# EAGLE board rcbussbc (EAGLE 9.6.2)
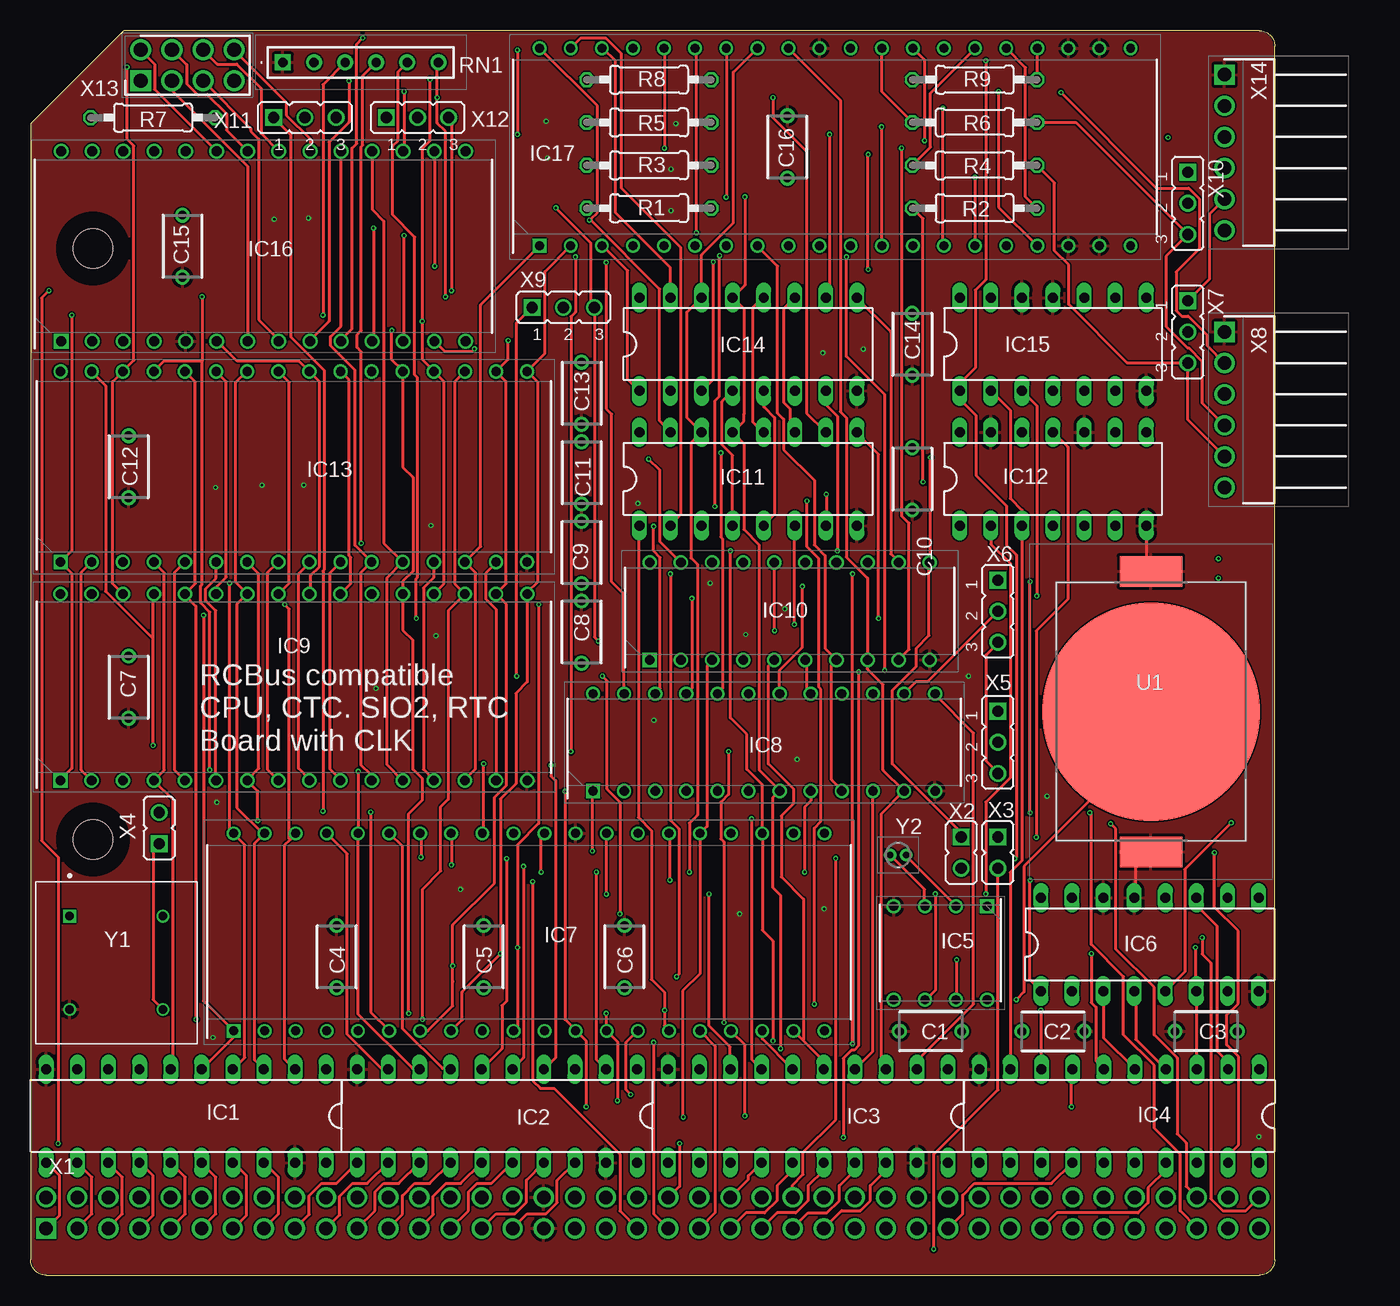
[diagram p2: board, top side]
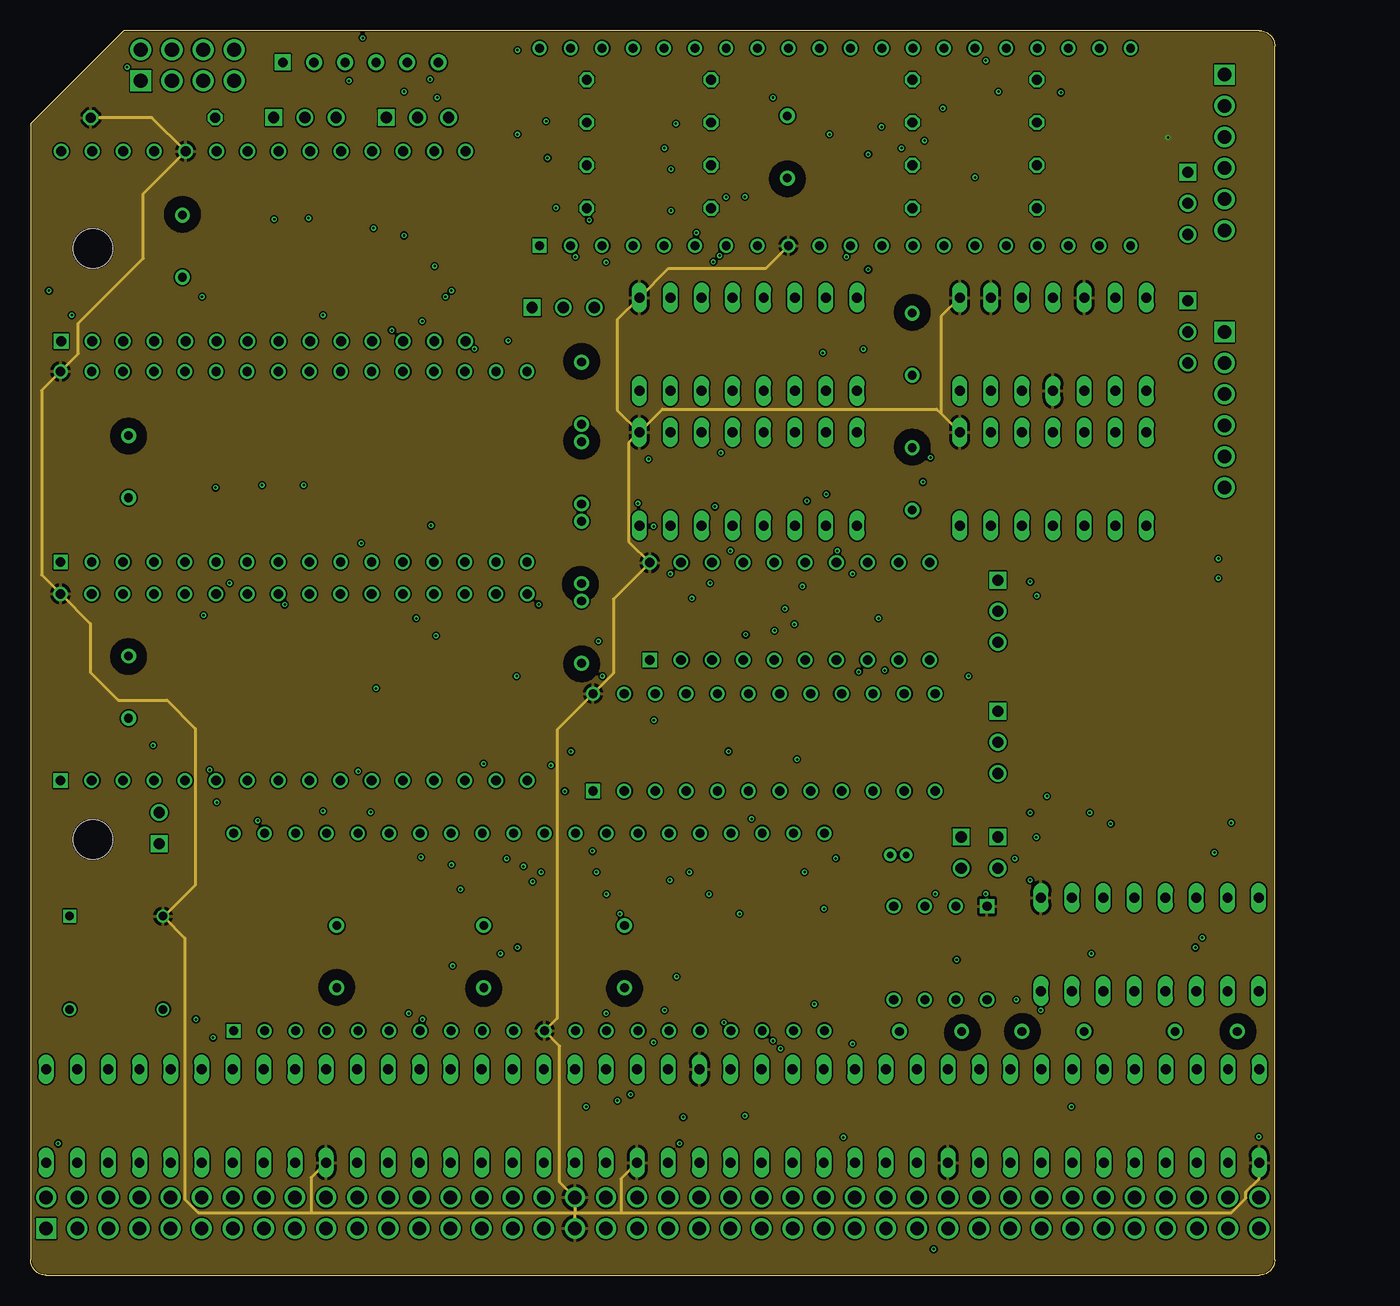
[diagram p3: board, inner layer Route2]
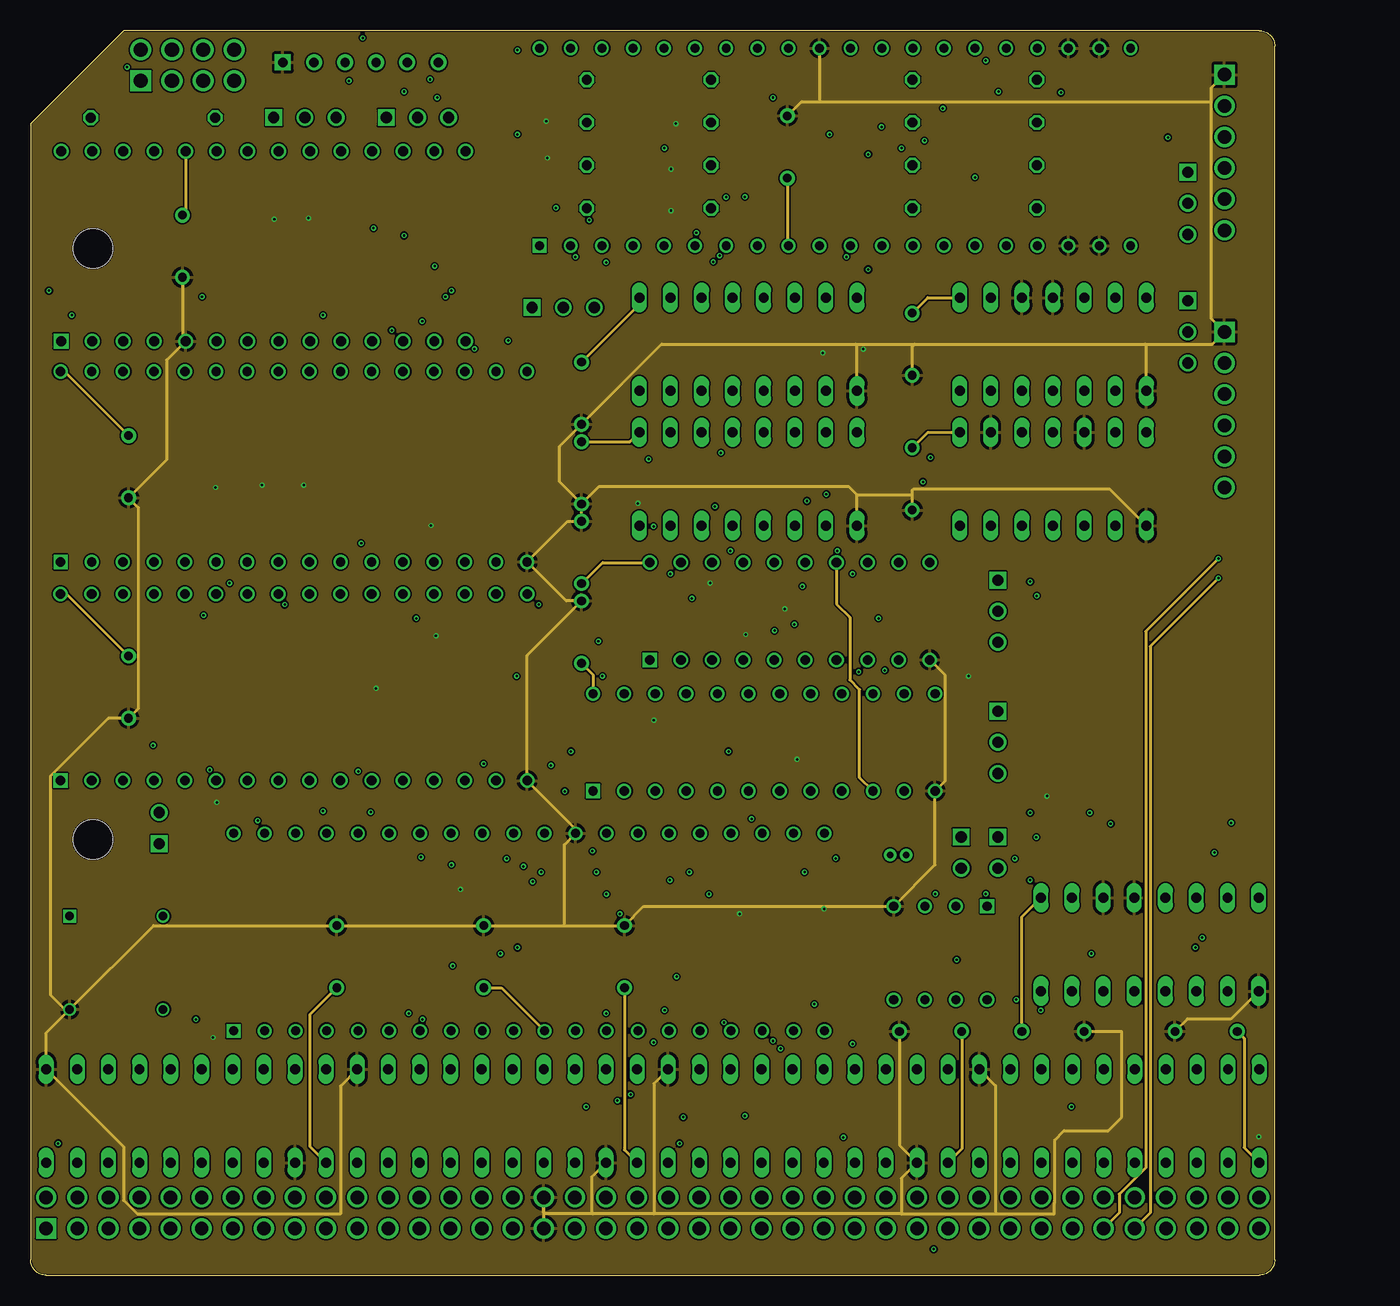
[diagram p4: board, inner layer Route15]
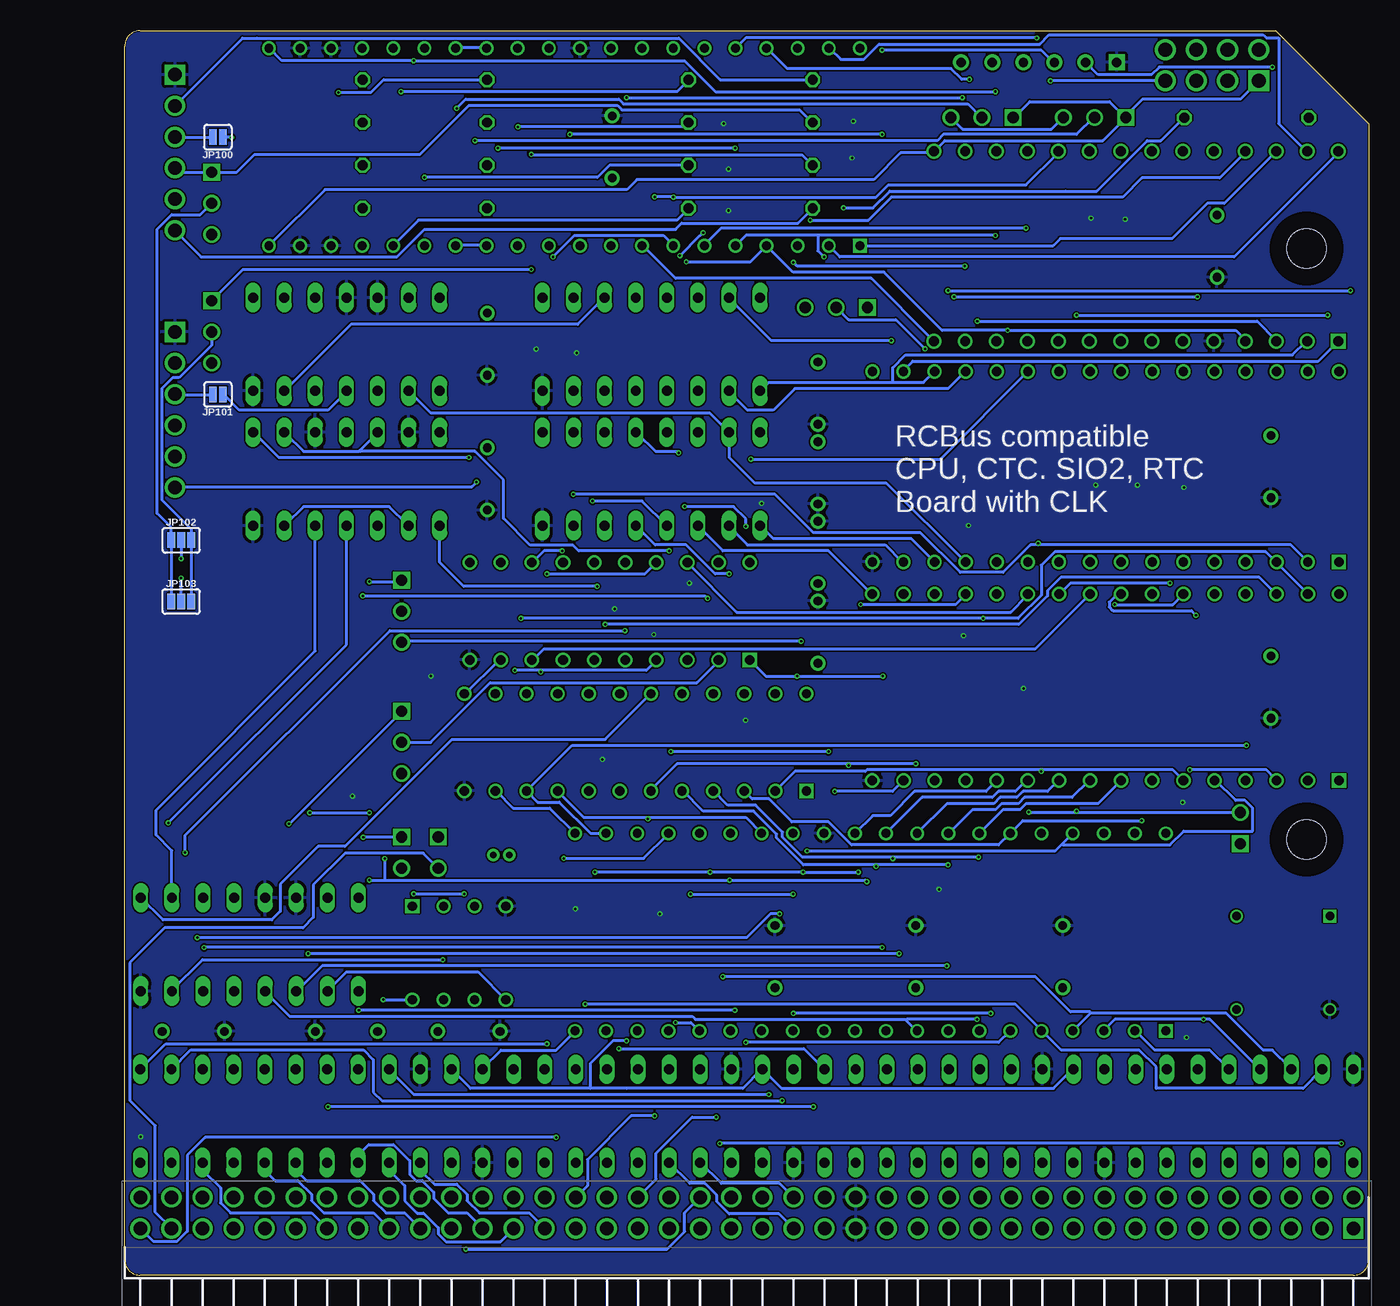
[diagram p5: board, bottom side, seen from below]

Size 101.6 x 101.6 mm. Coordinates in mm from the lower left corner, seen from the top.
Outline: 1.27,0 100.33,0 arc90 101.6,1.27 101.6,100.33 arc90 100.33,101.6 7.62,101.6 0,93.98 0,1.27 arc90 1.27,0
Copper layers (1*2*15*16): Top 0.035mm / dielectric 0.2mm / Route2 0.0175mm / dielectric 1.065mm / Route15 0.0175mm / dielectric 0.2mm / Bottom 0.035mm
Design rules "jlcpcb-4-layer_laci": minimum track width 5mil, minimum drill 0.2mm, track to track 0.126490625mm, track to pad 0.126490625mm, pad to pad 0.126490625mm, via to via 0.126490625mm, smd to smd 0mil, copper to edge 0.1mm, drill to drill 5mil, minimum pad ring 4mil, minimum via ring 4mil, stop-mask expansion 3mil, vias tented up to drill 100mil, thermal gap 10mil
Net classes: 0 default: width 0.254 mm; 1 pwr: width 0.762 mm
Holes 3.2 mm at 5.08,35.56 5.08,83.82
tRestrict: area 2.1,32.6 to 8.1,38.6; area 2.1,80.8 to 8.1,86.8
bRestrict: area 2.1,80.8 to 8.1,86.8; area 2.1,32.6 to 8.1,38.6

## Footprints (pad centres in the part's own frame; a part is rotated, then mirrored left to right if it is on the bottom)
C322C104K1R5TA = drill 0.71 pad 1.21: 1 -2.54,0; 2 2.54,0
DIL20 = drill 0.813 long: 1 -11.43,-3.81; 2 -8.89,-3.81; 3 -6.35,-3.81; 4 -3.81,-3.81; 5 -1.27,-3.81; 6 1.27,-3.81; 7 3.81,-3.81; 8 6.35,-3.81; 9 8.89,-3.81; 10 11.43,-3.81; 11 11.43,3.81; 12 8.89,3.81; 13 6.35,3.81; 14 3.81,3.81; 15 1.27,3.81; 16 -1.27,3.81; 17 -3.81,3.81; 18 -6.35,3.81; 19 -8.89,3.81; 20 -11.43,3.81
DIP762W56P254L938H457Q8N = drill 0.76 pad 1.16 square: 1 -3.81,3.81 | drill 0.76 pad 1.16: 2 -3.81,1.27; 3 -3.81,-1.27; 4 -3.81,-3.81; 5 3.81,-3.81; 6 3.81,-1.27; 7 3.81,1.27; 8 3.81,3.81
DIL16 = drill 0.813 long: 1 -8.89,-3.81; 2 -6.35,-3.81; 3 -3.81,-3.81; 4 -1.27,-3.81; 5 1.27,-3.81; 6 3.81,-3.81; 7 6.35,-3.81; 8 8.89,-3.81; 9 8.89,3.81; 10 6.35,3.81; 11 3.81,3.81; 12 1.27,3.81; 13 -1.27,3.81; 14 -3.81,3.81; 15 -6.35,3.81; 16 -8.89,3.81
DIP1612W53P254L5232H406Q40N = drill 0.73 pad 1.13 square: 1 -8.062,24.13 | drill 0.73 pad 1.13: 2 -8.062,21.59; 3 -8.062,19.05; 4 -8.062,16.51; 5 -8.062,13.97; 6 -8.062,11.43; 7 -8.062,8.89; 8 -8.062,6.35; 9 -8.062,3.81; 10 -8.062,1.27; 11 -8.062,-1.27; 12 -8.062,-3.81; 13 -8.062,-6.35; 14 -8.062,-8.89; 15 -8.062,-11.43; 16 -8.062,-13.97; 17 -8.062,-16.51; 18 -8.062,-19.05; 19 -8.062,-21.59; 20 -8.062,-24.13; 21 8.062,-24.13; 22 8.062,-21.59; 23 8.062,-19.05; 24 8.062,-16.51; 25 8.062,-13.97; 26 8.062,-11.43; 27 8.062,-8.89; 28 8.062,-6.35; 29 8.062,-3.81; 30 8.062,-1.27; 31 8.062,1.27; 32 8.062,3.81; 33 8.062,6.35; 34 8.062,8.89; 35 8.062,11.43; 36 8.062,13.97; 37 8.062,16.51; 38 8.062,19.05; 39 8.062,21.59; 40 8.062,24.13
DIP794W56P254L3188H533Q24N = drill 0.759 pad 1.159 square: 1 -3.969,13.97 | drill 0.759 pad 1.159: 2 -3.969,11.43; 3 -3.969,8.89; 4 -3.969,6.35; 5 -3.969,3.81; 6 -3.969,1.27; 7 -3.969,-1.27; 8 -3.969,-3.81; 9 -3.969,-6.35; 10 -3.969,-8.89; 11 -3.969,-11.43; 12 -3.969,-13.97; 13 3.969,-13.97; 14 3.969,-11.43; 15 3.969,-8.89; 16 3.969,-6.35; 17 3.969,-3.81; 18 3.969,-1.27; 19 3.969,1.27; 20 3.969,3.81; 21 3.969,6.35; 22 3.969,8.89; 23 3.969,11.43; 24 3.969,13.97
DIP1524W58P254L4191H406Q32N = drill 0.784 pad 1.184 square: 1 -7.62,19.05 | drill 0.784 pad 1.184: 2 -7.62,16.51; 3 -7.62,13.97; 4 -7.62,11.43; 5 -7.62,8.89; 6 -7.62,6.35; 7 -7.62,3.81; 8 -7.62,1.27; 9 -7.62,-1.27; 10 -7.62,-3.81; 11 -7.62,-6.35; 12 -7.62,-8.89; 13 -7.62,-11.43; 14 -7.62,-13.97; 15 -7.62,-16.51; 16 -7.62,-19.05; 17 7.62,-19.05; 18 7.62,-16.51; 19 7.62,-13.97; 20 7.62,-11.43; 21 7.62,-8.89; 22 7.62,-6.35; 23 7.62,-3.81; 24 7.62,-1.27; 25 7.62,1.27; 26 7.62,3.81; 27 7.62,6.35; 28 7.62,8.89; 29 7.62,11.43; 30 7.62,13.97; 31 7.62,16.51; 32 7.62,19.05
DIP794W59P254L2591H533Q20N = drill 0.788 pad 1.188 square: 1 -3.969,11.43 | drill 0.788 pad 1.188: 2 -3.969,8.89; 3 -3.969,6.35; 4 -3.969,3.81; 5 -3.969,1.27; 6 -3.969,-1.27; 7 -3.969,-3.81; 8 -3.969,-6.35; 9 -3.969,-8.89; 10 -3.969,-11.43; 11 3.969,-11.43; 12 3.969,-8.89; 13 3.969,-6.35; 14 3.969,-3.81; 15 3.969,-1.27; 16 3.969,1.27; 17 3.969,3.81; 18 3.969,6.35; 19 3.969,8.89; 20 3.969,11.43
DIL14 = drill 0.813 long: 1 -7.62,-3.81; 2 -5.08,-3.81; 3 -2.54,-3.81; 4 0,-3.81; 5 2.54,-3.81; 6 5.08,-3.81; 7 7.62,-3.81; 8 7.62,3.81; 9 5.08,3.81; 10 2.54,3.81; 11 0,3.81; 12 -2.54,3.81; 13 -5.08,3.81; 14 -7.62,3.81
DIP1556W56P254L4191H508Q32N = drill 0.758 pad 1.158 square: 1 -7.779,19.05 | drill 0.758 pad 1.158: 2 -7.779,16.51; 3 -7.779,13.97; 4 -7.779,11.43; 5 -7.779,8.89; 6 -7.779,6.35; 7 -7.779,3.81; 8 -7.779,1.27; 9 -7.779,-1.27; 10 -7.779,-3.81; 11 -7.779,-6.35; 12 -7.779,-8.89; 13 -7.779,-11.43; 14 -7.779,-13.97; 15 -7.779,-16.51; 16 -7.779,-19.05; 17 7.779,-19.05; 18 7.779,-16.51; 19 7.779,-13.97; 20 7.779,-11.43; 21 7.779,-8.89; 22 7.779,-6.35; 23 7.779,-3.81; 24 7.779,-1.27; 25 7.779,1.27; 26 7.779,3.81; 27 7.779,6.35; 28 7.779,8.89; 29 7.779,11.43; 30 7.779,13.97; 31 7.779,16.51; 32 7.779,19.05
DIL28 = drill 0.813 square: 1 -7.748,16.51 | drill 0.813: 2 -7.748,13.97; 3 -7.748,11.43; 4 -7.748,8.89; 5 -7.748,6.35; 6 -7.748,3.81; 7 -7.748,1.27; 8 -7.748,-1.27; 9 -7.748,-3.81; 10 -7.748,-6.35; 11 -7.748,-8.89; 12 -7.748,-11.43; 13 -7.748,-13.97; 14 -7.748,-16.51; 15 7.748,-16.51; 16 7.748,-13.97; 17 7.748,-11.43; 18 7.748,-8.89; 19 7.748,-6.35; 20 7.748,-3.81; 21 7.748,-1.27; 22 7.748,1.27; 23 7.748,3.81; 24 7.748,6.35; 25 7.748,8.89; 26 7.748,11.43; 27 7.748,13.97; 28 7.748,16.51
SMT-JUMPER_2_NO_SILK = smd 0.635 x 1.27: 1 -0.406,0; 2 0.406,0
SMT-JUMPER_3_NO_SILK = smd 0.635 x 1.27: 1 -0.813,0; 2 0,0; 3 0.813,0
0207/10 = drill 0.813 octagon: 1 -5.08,0; 2 5.08,0
4606X101102LF = drill 0.76 pad 1.303 square: 1 0,0 | drill 0.76 pad 1.303: 2 2.54,0; 3 5.08,0; 4 7.62,0; 5 10.16,0; 6 12.7,0
BATHLD001 = smd 2.5 x 5.1: 1 11.45,0; 2 -11.45,0 | smd 17.8 x 17.8: 3 0,0
RC2014_80_RA = drill 1.1 pad 1.65 square: 1 0,0 | drill 1.1 pad 1.65: 2 0,2.54; 3 2.54,0; 4 2.54,2.54; 5 5.08,0; 6 5.08,2.54; 7 7.62,0; 8 7.62,2.54; 9 10.16,0; 10 10.16,2.54; 11 12.7,0; 12 12.7,2.54; 13 15.24,0; 14 15.24,2.54; 15 17.78,0; 16 17.78,2.54; 17 20.32,0; 18 20.32,2.54; 19 22.86,0; 20 22.86,2.54; 21 25.4,0; 22 25.4,2.54; 23 27.94,0; 24 27.94,2.54; 25 30.48,0; 26 30.48,2.54; 27 33.02,0; 28 33.02,2.54; 29 35.56,0; 30 35.56,2.54; 31 38.1,0; 32 38.1,2.54; 33 40.64,0; 34 40.64,2.54; 35 43.18,0; 36 43.18,2.54; 37 45.72,0; 38 45.72,2.54; 39 48.26,0; 40 48.26,2.54; 41 50.8,0; 42 50.8,2.54; 43 53.34,0; 44 53.34,2.54; 45 55.88,0; 46 55.88,2.54; 47 58.42,0; 48 58.42,2.54; 49 60.96,0; 50 60.96,2.54; 51 63.5,0; 52 63.5,2.54; 53 66.04,0; 54 66.04,2.54; 55 68.58,0; 56 68.58,2.54; 57 71.12,0; 58 71.12,2.54; 59 73.66,0; 60 73.66,2.54; 61 76.2,0; 62 76.2,2.54; 63 78.74,0; 64 78.74,2.54; 65 81.28,0; 66 81.28,2.54; 67 83.82,0; 68 83.82,2.54; 69 86.36,0; 70 86.36,2.54; 71 88.9,0; 72 88.9,2.54; 73 91.44,0; 74 91.44,2.54; 75 93.98,0; 76 93.98,2.54; 77 96.52,0; 78 96.52,2.54; 79 99.06,0; 80 99.06,2.54
JP1 = drill 0.914 square: 1 0,-1.27 | drill 0.914: 2 0,1.27
JP2 = drill 0.914 square: 1 -2.54,0 | drill 0.914: 2 0,0; 3 2.54,0
HDRRA6W64P254_1X6_1524X254X309 = drill 1.1 pad 1.65 square: 1 0,0 | drill 1.1 pad 1.65: 2 2.54,0; 3 5.08,0; 4 7.62,0; 5 10.16,0; 6 12.7,0
HDRV8W67P254_2X4_1016X483X858P = drill 1.15 pad 1.725 square: 1 0,0 | drill 1.15 pad 1.725: 2 0,2.54; 3 2.54,0; 4 2.54,2.54; 5 5.08,0; 6 5.08,2.54; 7 7.62,0; 8 7.62,2.54
ECS-2100AX-200 = drill 0.7 square: 1 -3.81,-3.81 | drill 0.7: 4 3.81,-3.81; 5 3.81,3.81; 8 -3.81,3.81
LFXTAL014219BULK = drill 0.5 pad 1: 1 0,0; 2 0,-1.3

## Placement (x,y rotation side)
C1  C322C104M5U5TA  [C322C104K1R5TA]  73.5,19.9 180 top
C2  C322C104M5U5TA  [C322C104K1R5TA]  83.5,19.9 0 top
C3  C322C104M5U5TA  [C322C104K1R5TA]  96,19.9 180 top
C4  C322C104M5U5TA  [C322C104K1R5TA]  25,26 90 top
C5  C322C104M5U5TA  [C322C104K1R5TA]  37,26 90 top
C6  C322C104M5U5TA  [C322C104K1R5TA]  48.5,26 90 top
C7  C322C104M5U5TA  [C322C104K1R5TA]  8,48 270 top
C8  C322C104M5U5TA  [C322C104K1R5TA]  45,52.5 90 top
C9  C322C104M5U5TA  [C322C104K1R5TA]  45,59 90 top
C10  C322C104M5U5TA  [C322C104K1R5TA]  72,65 270 top
C11  C322C104M5U5TA  [C322C104K1R5TA]  45,65.5 270 top
C12  C322C104M5U5TA  [C322C104K1R5TA]  8,66 270 top
C13  C322C104M5U5TA  [C322C104K1R5TA]  45,72 270 top
C14  C322C104M5U5TA  [C322C104K1R5TA]  72,76 270 top
C15  C322C104M5U5TA  [C322C104K1R5TA]  12.4,84 270 top
C16  C322C104M5U5TA  [C322C104K1R5TA]  61.8,92.1 90 top
IC1  74LS245N  [DIL20]  12.7,13 180 top
IC2  74LS245N  [DIL20]  38.1,13 180 top
IC3  74LS245N  [DIL20]  63.5,13 180 top
IC4  74LS245N  [DIL20]  88.9,13 180 top
IC5  DS1302N+  [DIP762W56P254L938H457Q8N]  74.3,26.3 270 top
IC6  74HCT174N  [DIL16]  91.4,27 0 top
IC7  Z80_CPU  [DIP1612W53P254L5232H406Q40N]  40.7,28 90 top
IC8  ATF22V10C-15PU  [DIP794W56P254L3188H533Q24N]  59.9,43.5 90 top
IC9  AS6C4008-55PCN  [DIP1524W58P254L4191H406Q32N]  21.5,48 90 top
IC10  ATF16V8B-15PU  [DIP794W59P254L2591H533Q20N]  62,54.2 90 top
IC11  74LS670N  [DIL16]  58.6,65 0 top
IC12  74AC125N  [DIL14]  83.5,65 0 top
IC13  SST39SF040-70-4C-PHE  [DIP1556W56P254L4191H508Q32N]  21.5,66 90 top
IC14  74LS670N  [DIL16]  58.6,76 0 top
IC15  74LS74N  [DIL14]  83.5,76 0 top
IC16  Z80_CTC  [DIL28]  19,84 90 top
IC17  Z80_SIO2  [DIP1612W53P254L5232H406Q40N]  65.7,92.1 90 top
JP100  JUMPER-SMT_2_NO_SILK  [SMT-JUMPER_2_NO_SILK]  94,92.9 180 bottom
JP101  JUMPER-SMT_2_NO_SILK  [SMT-JUMPER_2_NO_SILK]  94,71.9 180 bottom
JP102  JUMPER-SMT_3_NO_SILK  [SMT-JUMPER_3_NO_SILK]  97,60 0 bottom
JP103  JUMPER-SMT_3_NO_SILK  [SMT-JUMPER_3_NO_SILK]  97,55 0 bottom
R1  1k  [0207/10]  50.5,87.1 180 top
R2  1k  [0207/10]  77.1,87.1 180 top
R3  1k  [0207/10]  50.5,90.6 180 top
R4  1k  [0207/10]  77.1,90.6 0 top
R5  1k  [0207/10]  50.5,94.1 180 top
R6  1k  [0207/10]  77.1,94.1 0 top
R7  1k  [0207/10]  10,94.5 180 top
R8  1k  [0207/10]  50.5,97.6 180 top
R9  1k  [0207/10]  77.1,97.6 180 top
RN1  4606X-101-102LF  [4606X101102LF]  20.6,99 0 top
U1  BAT-HLD-001  [BATHLD001]  91.5,46 90 top
X1  [RC2014_80_RA]  1.27,3.81 0 top
X2  [JP1]  76,34.5 180 top
X3  [JP1]  79,34.5 180 top
X4  [JP1]  10.5,36.5 0 top
X5  [JP2]  79,43.5 270 top
X6  [JP2]  79,54.2 270 top
X7  [JP2]  94.5,77 270 top
X8  TSW-106-08-T-S-RA  [HDRRA6W64P254_1X6_1524X254X309]  97.5,77 270 top
X9  [JP2]  43.5,79 0 top
X10  [JP2]  94.5,87.5 270 top
X11  [JP2]  22.4,94.5 0 top
X12  [JP2]  31.6,94.5 0 top
X13  10129381-908002BLF  [HDRV8W67P254_2X4_1016X483X858P]  9,97.5 0 top
X14  TSW-106-08-T-S-RA  [HDRRA6W64P254_1X6_1524X254X309]  97.5,98 270 top
Y1  7.3MHz  [ECS-2100AX-200]  7,25.5 270 top
Y2  LFXTAL014219BULK  [LFXTAL014219BULK]  70.2,34.3 90 top

## Tracks (layer width: path | path; a pad name or v marks a point on that pad's centre or on a via)
5P  (via drill 0.2)
  Route2 0.254: Y1.8 10.86,29.26 | 10.86,29.26 12.6,27.52 12.6,6.2 13.7,5.1 22.9,5.1 | 22.9,5.1 44.5,5.1 | IC1.20 22.9,7.96 22.9,5.1 | IC4.20 100.33,7.88 99.25,6.8 99.25,6.29 98.06,5.1 48.2,5.1 | IC2.20 48.2,7.86 48.2,5.1 | R7.2 9.9,94.5 IC16.24 9.2,88.3 9.2,83 3.9,77.7 3.9,75.23 IC13.32 0.9,72.23 0.9,57.17 IC9.32 4.88,53.19 4.88,49.22 7.17,46.94 11.13,46.94 13.45,44.62 13.45,31.85 10.86,29.26 | IC17.9 60.05,82.2 52.1,82.2 IC14.16 47.9,78 47.9,70.62 IC11.16 | IC11.16 51.6,70.7 73.99,70.7 74.34,70.34 | 74.34,70.34 IC12.14 | IC15.14 74.34,78.28 74.34,70.34 | IC11.16 48.85,67.95 48.85,59.89 IC10.20 47.6,55.2 47.6,49.14 IC8.24 43,44.54 43,20.97 IC7.11 43.2,18.71 43.2,7.6 X1.36 44.5,6.3 44.5,5.1 | 44.5,5.1 48.2,5.1 | X1.35 44.45,5.05 44.5,5.1
  Route15 0.254: C6.1 48.5,10.22 IC2.20 | C5.1 38.45,23.46 IC7.11 | C4.1 22.8,21.26 22.8,10.52 IC1.20 | C1.1 76.04,10.3 IC3.20 | C3.1 99.1,19.34 99.1,10.42 IC4.20 | IC16.24 12.65,86.79 C15.1 | C8.1 45.93,49.03 IC8.24 | C9.1 46.71,58.17 IC10.20 | C11.1 48.94,68.04 IC11.16 | C13.1 49.71,79.25 IC14.16 | C14.1 73.27,79.81 IC15.14 | C10.1 73.27,68.81 IC12.14 | C16.1 61.8,84.13 IC17.9 | C2.1 80.96,29.26 IC6.16 | C12.1 2.76,73.78 IC13.32 | C7.1 2.92,55.62 IC9.32
  Bottom 0.254: JP101.1 93.5,71.88 92.25,70.62 85,70.62 83.5,72.12 IC15.4 | v92.88,92.88 93.5,92.88 JP100.1
  pour Route2: -0.1,0 -0.1,101.8 101.5,101.8 101.5,0
5PR  (via drill 0.2)
  Top 0.254: X5.3 79,41 78,42 78,50.62 79,51.62 X6.3 | v42.9,87.12 42.9,87.1 45.75,84.25 45.75,79.25 46,79 X9.3 46.04,52.09 v46.38,51.75
  Bottom 0.254: v42.9,87.12 40.5,87.12 39.12,88.5 24.75,88.5 22.23,88.5 18.1,92.62 17,92.62 15.12,94.5 R7.1 | v46.38,51.75 79,51.75 X6.3
!BUSACK  (via drill 0.2)
  Top 0.254: X3.2 79,15.12 73.75,9.88 v73.75,2.12
  Bottom 0.254: v73.75,2.12 57.31,2.12 55.88,3.56 55.88,5.08 X1.44
!BUSREQ  (via drill 0.2)
  Top 0.254: IC10.3 55.65,50.15 55.25,49.75 55.25,36.64 IC7.25 54.67,24.62 53.25,23.2 53.25,12.95 v53.3,12.9
  Bottom 0.254: X1.48 58.2,7.84 58.2,9.97 55.27,12.9 v53.3,12.9
!CTC_CE  (via drill 0.2)
  Top 0.254: IC16.16 33,91.72 v33,82.38 | v47,82.67 47,70.75 47.45,70.3 47.45,56.6 48.47,55.59 IC8.23
  Bottom 0.254: v33,82.38 46.7,82.38 v47,82.67
!DBUF  (via drill 0.2)
  Top 0.254: v60.75,52.62 60.75,58.12 IC10.16 | IC4.19 97.79,9.8 98.65,10.66 98.65,17.83 97.68,18.8 97.68,21.24 98.61,22.17 98.61,28.12 96.67,30.05 v96.67,34.5
  Bottom 0.254: v60.75,52.62 79.95,52.62 96.67,35.9 v96.67,34.5
!DTRA
  Bottom 0.254: IC17.16 79.62,84.12 77.62,86.12 56.5,86.12 55.62,87 R1.1
!DTRB
  Top 0.254: R2.1 81.25,88.03 81.25,98.58 IC17.25
!HALT
  Top 0.254: IC3.14 58.62,8.12 58.62,7.83 X1.46
!IHALT
  Top 0.254: IC3.6 59.75,19.29 IC7.18
!IIODI
  Top 0.254: IC8.14 72.33,48.47 73.27,48.47 X6.2
!IIORQ  (via drill 0.2)
  Top 0.254: IC8.13 73.88,47.38 77,44.25 77,22.12 72.5,17.62 72.5,16.88 IC3.2 | v27.12,101 26.62,100.5 26.62,92.38 26.25,92 26.25,77.25 25.35,76.35 IC16.10 | v71.12,92 71.12,62 71.74,61.39 71.74,57.8 71.74,57.74 71.74,51.08 IC10.9 | v51.75,92 51.75,100.12 IC17.36
  Bottom 0.254: IC8.13 73.75,47.5 71.12,50.12 71,50.12 IC10.9 | IC7.20 64.88,19.88 66.38,18.38 70.88,18.38 72.38,16.88 IC3.2 | v27.12,101 50.88,101 51.62,100.25 IC17.36 | v51.75,92 v71.12,92
!IM1  (via drill 0.2)
  Top 0.254: IC8.9 66.25,39.62 65.42,40.46 65.42,49.79 65.81,50.19 IC10.7 64.88,51.17 64.88,58.75 64,59.62 64,64.9 61.5,67.4 61.5,69.88 61,70.38 61,82.38 59.38,84 IC17.8 | IC3.7 58.88,17.62 v58.88,37.25
  Bottom 0.254: IC17.8 59.25,84 56.62,81.38 40.62,81.38 35.62,76.38 IC16.14 | 58.88,37.38 64.12,37.38 66.25,39.5 IC8.9 | 58.88,37.38 50.88,37.38 49.62,36.12 IC7.27 | v58.88,37.25 58.88,37.38
!IMEMDI
  Bottom 0.254: X5.2 76.62,43.5 71.75,48.38 54.88,48.38 53.12,50.12 IC10.2
!IMREQ
  Top 0.254: 63.06,19.19 64.75,17.5 64.75,16.88 IC3.5 | 63.06,19.19 62.38,19.88 IC7.19 | IC10.5 60.62,50.12 60.25,49.75 60.25,41.75 62.3,39.7 62.3,38.5 61.3,37.5 61.3,32.52 63.12,30.7 63.12,19.25 63.06,19.19
!INT  (via drill 0.2)
  Top 0.254: X1.43 54.55,3.85 54.65,3.85 55.9,5.1 55.9,18.71 IC7.16 | v56.62,20.62 56.62,35.38 56.38,35.62 56.38,38.62 57,39.25 v57,42.75 | v44.12,42.75 44.12,78.25 44.5,78.62 v44.5,83.12 | IC16.12 30.5,76.32 v30.5,84.88
  Bottom 0.254: v30.5,84.88 45,84.88 | 45,84.88 50.88,84.88 51.62,84.12 IC17.5 | v56.62,20.62 55.38,20.62 54.75,20 IC7.16 | v44.12,42.75 v57,42.75 | v44.5,83.12 45,83.62 45,84.88
!IODI  (via drill 0.2)
  Top 0.254: v81.62,37.75 v81.62,56.62 | v86.5,37.75 86.62,37.62 86.62,27 89.25,24.38 89.25,19.62 91.75,17.12 91.75,12 93.88,9.88 93.88,5.25 95.25,3.88 X1.75
  Bottom 0.254: v81.62,56.62 79,56.62 X6.1 | v86.5,37.75 v81.62,37.75
!IORQ
  Top 0.254: X1.51 66.23,5.27 67.76,5.27 68.58,6.09 68.58,7.31 69.85,8.58 IC3.18
!IRD
  Top 0.254: IC17.32 66.12,95.93 66.12,70.5 66.62,70 66.62,58.62 68.35,56.9 IC10.8 68.35,49.48 69.62,48.2 69.62,41.24 IC8.11 69.45,37.65 69.45,17.21 IC3.3 | IC9.24 22.88,55.73 22.88,57.12 23.6,57.85 23.6,72.95 IC13.24 21.92,74.62 16.88,74.62 15.25,76.25 IC16.6
  Bottom 0.254: IC9.24 22.88,55.5 27.25,51.12 67.38,51.12 68.25,50.25 IC10.8 | IC8.11 71.28,39.53 69.88,38.12 66.89,38.12 IC7.21
!IRFSH  (via drill 0.2)
  Top 0.254: IC3.8 57.12,16.84 57.12,18.64 55.4,20.37 v55.4,31.1 | v47.02,31.1 47.05,31.12 IC7.28
  Bottom 0.254: v55.4,31.1 v47.02,31.1
!IWR  (via drill 0.2)
  Top 0.254: IC9.29 10,55.5 10,51.95 | IC3.4 68.75,18.25 68.75,39.49 IC8.10 | v10,43.25 10,51.95 | IC13.31 4.99,73.76 6.12,72.62 6.12,55.83 10,51.95
  Route15 0.254: IC10.14 65.81,54.79 66.9,53.7 66.9,48.6 67.7,47.8 67.7,40.62 IC8.10
  Bottom 0.254: v10,43.25 65.07,43.25 IC8.10 67.88,38.62 66.12,38.62 63.56,36.06 IC7.22
!M1
  Bottom 0.254: X1.37 48.18,5 52.24,5 53.25,6 53.25,6.51 54.23,7.5 55.46,7.5 IC3.13
!MEMDI  (via drill 0.2)
  Top 0.254: v88.2,36.85 88.62,36.42 88.62,26.62 91.75,23.5 91.75,19.62 93.64,17.74 93.64,11.54 94.38,10.8 94.38,7.25 95.25,6.38 X1.76
  Bottom 0.254: v88.2,36.85 88.15,36.85 79,46 X5.1
!MREQ
  Top 0.254: IC3.15 62.23,8.58 60.96,7.31 60.96,6.09 59.95,5.08 58.42,5.08 X1.45
!NMI  (via drill 0.2)
  Top 0.254: v58.33,13 58.33,18.8 57.25,19.88 IC7.17
  Bottom 0.254: X1.52 63.81,7.31 63.81,9.44 60.25,13 v58.33,13
!PG_WR  (via drill 0.2)
  Top 0.254: v56.38,67.12 56.38,60.25 56.5,60.12 56.5,47.88 56.12,47.5 IC8.20 | IC14.12 59.75,79.75 59,79 59,69.62 59.75,68.88 IC11.12
  Bottom 0.254: v56.38,67.12 56.5,67.25 58.25,67.25 59.75,68.75 IC11.12
!PGEN_WR  (via drill 0.2)
  Top 0.254: v54,55.25 54,47.92 IC8.21 | v82.17,55.45 82.2,55.48 82.2,70.95 IC15.3
  Bottom 0.254: v82.17,55.45 54.2,55.45 v54,55.25
!RAM_CS
  Bottom 0.254: IC9.22 27.88,55.5 29.25,54.12 51.62,54.12 55.62,58.12 IC10.18
!RD
  Top 0.254: X1.49 63.5,5.08 65.03,5.08 66.04,6.09 66.04,7.31 67.31,8.58 IC3.17
!RESET  (via drill 0.2)
  Top 0.254: v81.62,32.25 81.62,24.12 82.5,23.25 IC6.1 | v80.38,34 80.5,34.12 80.5,58.8 79.7,59.6 79.7,62.8 77.2,65.3 77.2,70.2 75.88,71.52 IC15.1 75.88,72.8 77.15,74.07 77.15,80.42 78,81.27 v78,99.15 | v30.5,96.62 30.5,91.82 IC16.17 | v52.2,32.25 52.2,35.99 IC7.26 | X1.39 49.53,3.85 48.12,5.25 48.12,9.88 42.76,15.25 41.64,15.25 41,15.89 v41,32.12
  Bottom 0.254: v81.62,32.25 80.38,32.25 | v30.5,96.62 53.38,96.62 55.88,99.12 77.97,99.12 v78,99.15 88.78,99.15 89.79,100.16 IC17.21 | v80.38,34 80.38,32.25 | v41,32.12 41.12,32.25 v52.2,32.25 80.38,32.25
!RFSH
  Bottom 0.254: IC3.12 54.56,9.19 52.88,7.5 48.14,7.5 X1.38
!ROM_CS  (via drill 0.2)
  Top 0.254: IC10.19 51.39,59.89 51.39,65.71 v50.48,66.62
  Bottom 0.254: v50.48,66.62 35,66.62 IC13.22
!RTC_RD  (via drill 0.2)
  Top 0.254: IC8.18 61.17,49.4 63.02,51.26 v63.02,56.23
  Bottom 0.254: IC12.1 75.88,58.18 73.92,56.23 v63.02,56.23
!RTC_WR
  Bottom 0.254: IC8.19 58.75,47.38 62.38,43.75 74.88,43.75 83.62,35 85.8,35 88.9,31.9 88.9,29.7 89.6,29 98.48,29 IC6.9
!RTSA  (via drill 0.2)
  Top 0.254: v79.05,96.62 79.05,87.2 IC17.17
  Bottom 0.254: v79.05,96.62 56.5,96.62 55.62,97.5 R8.1
!RTSB
  Top 0.254: R9.1 82.21,97.63 IC17.24
!SIO_CE  (via drill 0.2)
  Top 0.254: v54.38,85.1 54.38,100.12 IC17.35 | v56.27,83.22 56.25,83.2 56.25,71.75 55.88,71.38 v55.88,62.75 | v50.88,61.12 50.88,59.12 51.42,58.58 51.42,47.88 IC8.22
  Bottom 0.254: v54.38,85.1 54.6,84.88 54.62,84.88 v56.27,83.22 | v55.88,62.75 51.88,62.75 50.88,61.75 v50.88,61.12
!WAIT  (via drill 0.2)
  Top 0.254: X1.50 62.23,7.36 63.09,8.22 63.09,10.04 65.75,12.7 v65.75,34.02
  Bottom 0.254: v65.75,34.02 59.23,34.02 57.25,36 IC7.24
!WR
  Top 0.254: IC3.16 64.77,8.58 63.5,7.31 63.5,6.09 62.48,5.08 60.96,5.08 X1.47
A0
  Top 0.254: X1.31 40.56,5 42.09,5 43,5.92 43,7.74 IC2.18
A1
  Top 0.254: IC2.17 41.91,9.16 40.5,7.75 40.5,5.96 39.55,5 38.02,5 X1.29
A2
  Top 0.254: IC2.16 39.31,9.19 37.62,7.5 36.45,7.5 35.75,6.79 35.75,5.27 X1.27
A3
  Top 0.254: IC2.15 36.81,9.19 35.12,7.5 33.91,7.5 32.88,6.46 32.88,5 32.88,4.93 X1.25
A4
  Top 0.254: IC2.14 32.6,7.5 31.38,7.5 30.38,6.5 30.38,4.97 X1.23
A5
  Top 0.254: X1.21 28.12,5.26 28.12,6.79 28.84,7.5 30.06,7.5 IC2.13
A6
  Top 0.254: X1.19 25.25,4.93 25.25,6.46 26.3,7.5 27.5,7.5 29.19,9.19 IC2.12
A7
  Top 0.254: IC2.11 24.98,7.5 23.75,7.5 22.75,6.5 22.75,4.97 X1.17
A8
  Top 0.254: IC1.18 19.12,9.12 20.25,8 20.25,5 19.12,3.88 X1.15
A9
  Top 0.254: IC1.17 16.62,9.12 17.62,8.12 17.62,4.88 16.62,3.88 X1.13
A10
  Top 0.254: IC1.16 14,9.12 15.12,8 15.12,5 14,3.88 X1.11
A11
  Top 0.254: IC1.15 11.5,9.12 12.62,8 12.62,5 11.5,3.88 X1.9
A12
  Top 0.254: IC1.14 9,9.12 10,8.12 10,4.88 9,3.88 X1.7
A13
  Top 0.254: IC1.13 6.38,9.12 7.5,8 7.5,5 6.38,3.88 X1.5
A14
  Top 0.254: IC1.12 5,8 5,5 X1.3
A15
  Top 0.254: IC1.11 1.38,9.12 2.38,8.12 2.38,4.88 1.38,3.88 X1.1
ABDIR  (via drill 0.2)
  Top 0.254: v60.62,19.12 60.62,27.29 59.75,28.16 IC7.23 59.75,40.05 58.5,41.3 58.5,44.15 57.15,45.5 v57.15,59.12
  Bottom 0.254: 82.44,67.31 82.5,67.25 87,67.25 88.5,68.75 IC12.9 | 82.44,67.31 81,68.75 IC12.12 | IC1.1 24.25,16.75 25.75,15.25 47.97,15.25 IC2.1 49.62,16.75 51.12,15.25 60.62,15.25 63.6,15.25 | 63.6,15.25 73.38,15.25 74.88,16.75 IC3.1 | 82.44,67.31 82.38,67.25 73,67.25 70.67,64.92 70.67,61.77 68.5,59.6 65,59.6 64.53,59.12 v57.15,59.12 | v60.62,19.12 61.74,19.12 63.6,17.27 63.6,15.25
BAO
  Bottom 0.254: X1.77 99.1,5.12 99.1,12.2 101.19,14.29 101.19,25.5 98.35,28.35 87.05,28.35 86.2,29.2 86.2,31.86 83.6,34.45 77.22,34.45 X2.2
CLK  (via drill 0.2)
  Top 0.254: v27.77,37.8 27.77,21.48 29.27,19.98 IC7.6 | v50.88,19 50.88,5 52,3.88 X1.41 | v23.88,37.88 23.88,57.5 23.98,57.61 23.98,73.86 21.25,76.59 21.25,93.11 X11.1
  Bottom 0.254: v27.77,37.8 27.73,37.75 23.88,37.75 | 23.88,37.75 10.5,37.75 X4.2 | v50.88,19 30.25,19 29.38,19.88 IC7.6 | 19.94,94.56 21.18,95.8 27.7,95.8 29,94.5 X12.1 | 19.94,94.56 19.88,94.5 X11.1 21.73,92.62 34.63,92.62 IC16.15 35.62,91.62 38.25,91.62 40.44,89.44 59.79,89.44 60.6,88.62 85.25,88.62 89.75,84.12 IC17.20 | v23.88,37.88 23.88,37.75 | 19.94,94.56 18.5,96 10.5,96 X13.1
CLK2  (via drill 0.2)
  Top 0.254: v53,10.75 53,7.25 52.12,6.38 X1.42 | v2.25,10.75 2.25,34.12 0.9,35.48 0.9,79.78 v1.5,80.38 | X12.3 34.38,94.27 v34.38,80.38
  Bottom 0.254: X11.3 25,94.5 25.94,93.56 33.19,93.56 34.12,94.5 X12.3 | v2.25,10.75 v53,10.75 | v34.38,80.38 v1.5,80.38
CLKA  (via drill 0.2)
  Top 0.254: v74.5,95.25 74.5,84.12 IC17.14
  Bottom 0.254: IC17.13 72.12,84.12 74.5,84.12 IC17.14 | v74.5,95.25 73.75,96 61.25,96 60.88,95.62 32.75,95.62 31.62,94.5 X12.2
CLKB  (via drill 0.2)
  Top 0.254: IC17.28 73,99.21 v73,92.62
  Bottom 0.254: IC17.28 72.12,100.25 74.5,100.25 IC17.27 | v73,92.62 35.25,92.62 34.75,93.12 23.88,93.12 22.5,94.5 X11.2
D0
  Bottom 0.254: IC4.11 77.47,8.58 76.32,7.43 74.48,7.43 73.66,6.61 73.66,6.09 72.64,5.08 68.58,5.08 X1.53
D1
  Bottom 0.254: IC4.12 80.01,8.58 78.74,7.31 78.74,6.09 77.72,5.07 77.21,5.07 76.01,3.87 76.01,3.36 75.38,2.73 70.93,2.73 X1.55
D2
  Bottom 0.254: IC4.13 82.55,9.8 81.69,10.66 79.65,10.66 78.33,9.34 78.33,8.22 77.83,7.72 77.31,7.72 76.38,6.78 76.38,6.27 75.19,5.08 73.66,5.08 X1.57
D3
  Top 0.254: IC4.14 85.06,9.19 83.38,7.5 77.09,7.5 76.12,6.53 76.12,5 X1.59
D4
  Bottom 0.254: IC4.15 87.63,8.58 86.77,7.72 82.39,7.72 81.28,6.61 81.28,6.09 80.27,5.08 78.74,5.08 X1.61
D5
  Bottom 0.254: IC4.16 90.17,8.58 89.31,7.72 87.47,7.72 86.36,6.61 86.36,6.09 85.34,5.08 81.28,5.08 X1.63
D6
  Top 0.254: IC4.17 92.71,8.58 91.25,7.12 91.25,5.9 90.42,5.08 83.82,5.08 X1.65
D7
  Bottom 0.254: IC4.18 95.25,8.58 93.79,7.12 93.79,5.9 92.97,5.08 86.36,5.08 X1.67
DDIR  (via drill 0.2)
  Top 0.254: v67.12,18.88 v67.12,57.25
  Bottom 0.254: v67.12,57.25 59.12,57.25 58.25,58.12 IC10.17 | v67.12,18.88 98.25,18.88 100.25,16.88 IC4.1
GND  (via drill 0.2)
  Top 0.254: U1.2 91.5,34.5 90.25,33.25 90.25,30.88 IC6.13 | U1.1 91.5,57.5 91.12,57.88 91.12,61.12 IC12.7
  Route15 0.254: 3,21.5 1.27,19.77 IC1.10 7.6,10.48 7.6,6.12 8.71,5 25.3,5 25.3,15.44 IC2.10 | 3,21.5 Y1.4 10.03,28.53 11.13,28.53 11.14,28.54 C4.2 C5.2 43.6,28.54 | 43.6,28.54 C6.2 50.07,30.11 IC5.4 73.87,33.49 IC8.12 74.69,40.35 74.69,48.97 IC10.10 | 71.1,5 71.1,7.9 IC3.19 70.96,10.62 C1.2 | IC2.19 45.8,8 45.8,5.1 45.9,5 | C2.2 89.1,19.9 89.1,12.9 88,11.8 84.4,11.8 83.63,11.03 83.63,5.9 83.6,5.88 83.6,5 78.8,5 | C15.2 12.4,76.5 IC16.5 11.1,74.7 11.1,66.56 C12.2 8.8,62.66 8.8,46.26 C7.2 6.34,45.46 1.61,40.73 1.61,22.89 3,21.5 | 71.1,5 78.8,5 | 43.6,28.54 43.6,35.15 IC7.29 44.51,36.42 IC9.16 40.55,50.59 C8.2 43.73,55.04 IC13.16 43.87,61.54 C9.2 C11.2 | C11.2 43.2,64.76 43.2,67.66 C13.2 51.54,76 67.4,76 | C11.2 46.44,64.4 66.8,64.4 67.49,63.71 | IC12.7 88.11,64.2 72.1,64.2 72,64.1 72,63.7 | C10.2 72,63.7 | IC11.8 67.49,63.71 | 67.4,76 72.2,76 | 72.2,76 91,76 | 91,76 96.5,76 X8.1 96.42,78.08 96.42,95.8 | IC15.7 91.12,75.88 91,76 | C14.2 72,75.8 72.2,76 | IC14.8 67.49,75.91 67.4,76 | IC3.10 50.9,15.64 50.9,5 | IC4.10 78.8,15.48 78.8,5 | 96.42,95.8 96.42,96.92 X14.1 | C16.2 62.96,95.8 64.5,95.8 | 64.5,95.8 96.42,95.8 | IC17.31 64.43,95.87 64.5,95.8 | IC6.8 98,20.9 94.46,20.9 C3.2 | 71.1,5 50.9,5 | 50.9,5 45.9,5 | 45.9,5 42,5 41.91,5.09 X1.34 X1.33 | 67.49,63.71 67.5,63.7 72,63.7
  other vias: 42.2,91.2 42.1,94.2 52.3,90.3 52.3,86.9 52.7,94 33.1,52.2 49.6,63 15.2,38.6 14.9,19.4 100.3,11.3 18.9,64.5 22.3,64.5 28.2,47.9 35.1,31.5 57.9,29.5 19.9,86.2 22.7,86.3 76.6,48.9 83,39.1 64.8,29.9 62.6,42.1 50.9,45.3 64.7,75.3 68,75.6 32.7,61.2 15.1,64.3 58.4,52.3 55.5,56.5 61.6,54.4
  pour Route15: -0.1,0 -0.1,101.7 101.5,101.7 101.5,0
  pour Top: 0,0.1 0,101.8 102,101.8 102,0 -0.1,0
  pour Bottom: -0.1,-0.2 -0.1,101.8 101.8,101.8 101.8,-0.2
IA0  (via drill 0.2)
  Top 0.254: IC16.18 27.89,87.01 28.84,86.06 28.84,59.77 IC13.12 29.1,56.93 29.1,41.67 IC9.12 | IC2.2 46.2,17.6 v46.2,32.9 | v41.7,32.9 41.7,35.79 IC7.30 | IC8.8 63.71,38.71 63.2,38.2 v63.2,32.9 | IC17.33 57.4,98.21 57.4,85.9 54.79,83.29 IC14.14 53.6,78.62 53.6,70 IC11.14 53.93,67.95 53.93,58.55 54.45,58.02 54.45,37.55 53.8,36.9 v53.8,32.9
  Bottom 0.254: IC9.12 31.27,39.5 37.1,39.5 39.08,37.52 40.52,37.52 IC7.30 | v41.7,32.9 v46.2,32.9 v53.8,32.9 v63.2,32.9
IA1  (via drill 0.2)
  Top 0.254: v61.25,18.5 61.25,31 60.6,31.65 60.6,38.96 IC8.7 61.17,39.58 59.5,41.25 59.5,59.62 58.25,60.88 58.25,67.88 57.38,68.75 IC11.13 58.25,69.73 58.25,70.3 58.25,78.89 IC14.13 57.33,79.83 58.33,80.83 v58.33,88.03 | IC16.19 25.35,77.47 24.49,76.61 24.49,75.89 26.5,73.88 26.5,59.57 IC13.11 27,57.38 27,41.62 27.75,40.88 27.75,40.48 IC9.11 | IC17.34 v56.81,88.01 v56.8,88
  Bottom 0.254: IC16.19 25.38,91.62 28,89 39.25,89 40.25,88 v56.8,88 56.83,88.03 v58.33,88.03 | IC9.11 28,40.38 28.88,39.5 30.25,39.5 30.75,39 36.49,39 IC7.31 | v61.25,18.5 46.14,18.5 IC2.3
IA2  (via drill 0.2)
  Top 0.254: v37,41.75 37,36.12 IC7.32 | v42.5,41.62 42.5,40.75 42.88,40.38 42.88,17.75 42,16.88 IC2.4 | IC9.10 25.31,40.44 24.46,41.28 24.46,57.34 25.31,58.19 IC13.10
  Bottom 0.254: v37,41.75 42.5,41.75 | 42.5,41.75 56.5,41.75 58.62,39.62 IC8.6 | v42.5,41.62 42.5,41.75 | IC9.10 25.37,40.38 26.25,39.5 28.25,39.5 28.75,39 30.12,39 30.62,38.5 34.45,38.5 IC7.32
IA3  (via drill 0.2)
  Top 0.254: IC13.9 22.75,58.12 21.88,57.25 21.88,41.38 22.75,40.5 IC9.9 | v34.38,33.5 34.38,36 IC7.33 | v40.25,33.38 40.25,17.75 39.38,16.88 IC2.5
  Bottom 0.254: v34.38,33.5 40.25,33.5 | v40.25,33.38 40.25,33.5 | IC9.9 22.87,40.38 24.25,39 28.12,39 28.62,38.5 30,38.5 30.5,38 32.38,38 34.31,36.06 IC7.33 | IC8.5 56.03,39.53 54.38,37.88 50.24,37.88 48.38,36.01 48.38,35.69 46.18,33.5 40.25,33.5
IA4  (via drill 0.2)
  Top 0.254: IC13.8 20.12,58.12 19.38,57.38 19.38,41.25 20.12,40.5 IC9.8 | v31.88,34.12 31.88,36 IC7.34 | v38.88,34 38.88,22.38 38.5,22 38.5,18.5 36.83,16.83 IC2.6
  Bottom 0.254: v31.88,34.12 38.88,34.12 | v38.88,34 38.88,34.12 | IC9.8 20.25,40.38 22.12,38.5 28,38.5 28.5,38 29.87,38 IC7.34 | IC8.4 53.53,39.53 52.38,38.38 50.09,38.38 47.88,36.16 47.88,35.73 46.27,34.12 38.88,34.12
IA5  (via drill 0.2)
  Top 0.254: IC13.7 17.75,58.12 18.62,57.25 18.62,41.38 17.75,40.5 IC9.7 18.55,39.52 v18.55,37.1 | IC7.35 29.38,36 30.38,35 30.38,20.12 33.62,16.88 34.25,16.88 IC2.7
  Bottom 0.254: IC8.3 51,39.5 50.38,38.88 49,38.88 47.12,37 44.12,37 42.25,35.12 30.25,35.12 29.38,36 IC7.35 29.25,36.12 28.27,37.1 v18.55,37.1
IA6  (via drill 0.2)
  Top 0.254: v26.75,41.12 26.75,36.12 IC7.36 26.73,21.32 31.18,16.88 31.68,16.88 IC2.8 | IC9.6 15.12,40.41 15.12,54.25 14.3,55.07 14.3,56.05 15.15,56.9 IC13.6
  Bottom 0.254: 26.75,41.25 16,41.25 15.25,40.5 IC9.6 | 26.75,41.25 41,41.25 41.12,41.12 46.88,41.12 48.38,39.62 IC8.2 | v26.75,41.12 26.75,41.25
IA7  (via drill 0.2)
  Top 0.254: v45.88,34.62 45.88,39.5 IC8.1 | IC9.5 11.77,41.23 11.77,57.38 IC13.5 | IC7.37 25.86,34.39 25.86,19.65 28.7,16.81 IC2.9
  Bottom 0.254: v45.88,34.62 25.62,34.62 25.06,35.19 | 25.06,35.19 24.25,36 IC7.37 | IC9.5 12.5,40.38 10.88,38.75 10.12,38.75 9.5,38.12 9.5,36.25 15.12,36.25 16.25,35.12 25,35.12 25.06,35.19
IA8  (via drill 0.2)
  Top 0.254: 21.19,35.56 20.75,35.12 20.75,17.62 21.5,16.88 IC1.2 | 21.19,35.56 21.62,36 IC7.38 | v20.75,54.75 21.12,54.38 21.12,35.62 21.19,35.56 | IC13.27 15.98,72.95 15.98,56.98 15.15,56.15 IC9.27
  Bottom 0.254: v20.75,54.75 16.02,54.75 IC9.27
IA9
  Top 0.254: IC13.26 17.62,73.75 16.75,72.88 16.75,56.56 IC9.26 16.84,54.77 16.84,38.16 18.94,36.06 IC7.39 18.29,35.24 18.29,17.58 19.05,16.82 IC1.3
IA10  (via drill 0.2)
  Top 0.254: IC1.4 16.62,16.88 17.5,17.75 17.5,35.12 16.62,36 IC7.40 16.5,36.12 16.25,36.38 v16.25,56.5 | IC9.23 26.14,56.45 26.14,58.61 26,58.75 26,73.09 IC13.23
  Bottom 0.254: v16.25,56.5 24.38,56.5 25.25,55.62 IC9.23
IA11  (via drill 0.2)
  Top 0.254: IC13.25 20.25,73.75 21.12,72.88 21.12,56.5 20.25,55.62 IC9.25 | v14.12,53.88 14.12,22.38 IC7.1 16.57,19.41 IC1.5
  Bottom 0.254: v14.12,53.88 14.5,54.25 20.89,54.25 21.2,54.56 21.2,54.94 20.64,55.5 20.35,55.5 IC9.25
IA12
  Top 0.254: IC13.4 10.07,58.18 10.91,57.34 10.91,41.23 IC9.4 11.59,38.86 11.59,16.97 IC1.6
  Bottom 0.254: IC7.2 19,19.88 17.5,18.38 13,18.38 11.5,16.88 IC1.6
IA13  (via drill 0.2)
  Top 0.254: v13.5,20.88 13.5,54.62 12.61,55.52 IC9.28 13.44,56.45 13.44,72.93 12.61,73.77 IC13.28
  Bottom 0.254: IC7.3 21.62,20 20.75,20.88 v13.5,20.88 13,20.88 9,16.88 IC1.7
IA14  (via drill 0.2)
  Top 0.254: IC11.5 59.88,61.25 60.75,62.12 60.75,70 59.88,70.88 59.88,72.12 IC14.5 | v52.25,57.25 52.25,37.12 52.95,36.43 52.95,24.57 v52.75,24.38
  Bottom 0.254: 22.75,21.38 24.12,20 IC7.4 | 22.75,21.38 11.62,21.38 8.62,18.38 7.88,18.38 6.38,16.88 IC1.8 | v52.75,24.38 27.25,24.38 24.38,21.5 22.75,21.5 22.75,21.38 | v52.25,57.25 53.39,57.25 55.75,59.61 58.29,59.61 IC11.5
IA15  (via drill 0.2)
  Top 0.254: v64,22.12 64,36.5 64.54,37.04 64.54,47.83 64.38,48 64.38,58.5 63.4,59.48 v63.4,63.2 | IC14.4 56.47,71.33 56.47,67.78 57.33,66.92 IC11.4
  Bottom 0.254: IC1.9 3.88,16.75 5.38,15.25 17.38,15.25 17.38,17 18.75,18.38 25.12,18.38 26.62,19.88 IC7.5 26.75,20 28.88,22.12 v64,22.12 | IC11.4 59.34,63.2 v63.4,63.2
IBAO  (via drill 0.2)
  Top 0.254: X2.1 76,36.12 70.38,41.75 70.38,47.75 72.33,49.7 72.33,51.17 73.38,52.23 73.38,58.12 IC10.11 73.5,58.25 v73.5,66.75
  Bottom 0.254: v73.5,66.75 89,66.75 91,68.75 IC12.8
ID0  (via drill 0.2)
  Top 0.254: v49,14.75 48.62,15.12 48.62,19 49.5,19.88 IC7.14 | IC15.2 78.5,72.12 80,70.62 80,63.42 80.96,62.46 IC12.3 80.96,33.84 80.01,32.88 IC4.9 | IC11.15 52.25,68.88 51.38,69.75 51.38,80.5 45.75,86.12 v45.62,86.12 45.74,86.24 45.78,86.24 46.28,86.74 46.28,95.45 IC17.40 | IC9.13 32.93,40.45 32.09,41.29 32.09,56.1 32.93,56.95 IC13.13
  Bottom 0.254: v49,14.75 78,14.75 80,16.75 IC4.9 | v45.62,86.12 40.88,86.12 39,88 20.1,88 18.52,89.58 12.18,89.58 10.12,91.62 IC16.25 | IC15.2 76.61,70.38 53.81,70.38 IC11.15 52.25,66.76 50.16,64.67 39.42,64.67 32.97,58.22 IC13.13
ID1  (via drill 0.2)
  Top 0.254: 51.75,21.62 51.75,23.1 50.7,24.15 50.7,36.3 49.62,37.38 49.62,61.12 IC11.1 | 51.75,21.62 51.75,20.38 52.12,20 IC7.15 | v82.5,21.62 82.5,16.88 IC4.8 | v51.77,21.62 51.75,21.62 | IC17.1 36.75,79.22 36.75,59.5 IC13.14 36.31,57.38 36.31,41.31 35.47,40.47 IC9.14
  Bottom 0.254: v51.77,21.62 v82.5,21.62 | IC11.1 49.62,61.12 48.62,60.12 37.38,60.12 35.5,58.25 IC13.14 | IC16.26 11.82,87.5 13.2,87.5 16.09,84.61 25.21,84.61 25.79,84.04 IC17.1
ID2  (via drill 0.2)
  Top 0.254: v43.62,39.5 43.62,20.88 44.5,20 IC7.12 44.62,19.88 45.38,19.12 v45.38,13.75 | v85,13.75 85,16.75 IC4.7 | IC11.2 52.25,61.25 53.11,62.11 53.11,83.89 48.25,88.75 48.25,99.72 46.99,100.98 44.93,100.98 IC17.39 | IC13.15 38.01,58.13 37.16,57.29 37.16,55.21 38.01,54.37 IC9.15
  Bottom 0.254: v45.38,13.75 v85,13.75 | IC13.15 38.12,58.25 39.5,59.62 50.75,59.62 52.25,61.12 IC11.2 | IC16.27 5.12,91.75 7.38,94 7.38,101 8.38,101 8.62,101.25 26.12,101.25 26.88,100.5 40,100.5 41.25,99.25 43.12,99.25 44,100.12 IC17.39 | IC9.15 38.89,39.5 v43.62,39.5
ID3  (via drill 0.2)
  Top 0.254: v86.62,26.25 86.62,22.25 87,21.88 87,17.5 87.62,16.88 IC4.6 | IC17.2 42,81.93 42,75.25 40.55,73.8 IC13.17 41.38,72.95 41.38,56.58 40.55,55.75 IC9.17 40.55,48.42 39.62,47.5 39.62,40.12 38.38,38.88 v38.38,26.25 35.26,23.13 35.26,20.84 IC7.8
  Bottom 0.254: IC16.28 2.5,91.62 11,83.12 43.2,83.12 IC17.2 | v38.38,26.25 v86.62,26.25 | IC11.3 54.75,61.12 52.75,59.12 44.12,59.12 40.62,55.62 IC9.17
ID4  (via drill 0.2)
  Top 0.254: IC14.15 52.25,82.25 47.75,86.75 47.75,99.12 46.75,100.12 IC17.38 | IC4.5 90.12,16.88 87.62,19.38 87.62,23.12 IC6.3 | v39,76.3 39,74.77 IC13.18 38.84,72.95 38.84,56.45 IC9.18 38.85,54.77 38.85,39.98 37.88,39 37.88,32 34.48,28.6 v34.48,25.25 34.48,24 34.48,23.93 34.48,21.98 32.44,19.94 IC7.7
  Bottom 0.254: IC16.1 4.12,74.62 37.25,74.62 38,73.88 IC13.18 | v34.48,25.25 85.5,25.25 87.5,23.25 IC6.3 | v39,76.3 48.8,76.3 52.25,79.75 IC14.15
ID5  (via drill 0.2)
  Top 0.254: IC4.4 92.62,16.88 90.25,19.25 90.25,23.12 IC6.4 | IC17.3 46.75,84 48.75,82 48.75,73.12 49.62,72.25 IC14.1 | IC13.19 34.64,72.95 34.64,56.45 IC9.19 34.1,54.25 34.1,38.85 33.5,38.25 33.5,33 32,31.5 v32,20.88
  Bottom 0.254: 37.81,20.81 37.88,20.88 55,20.88 55.25,21.12 88.12,21.12 90.12,23.12 IC6.4 | 37.81,20.81 37,20 IC7.9 | 38.88,72.88 49,72.88 49.62,72.25 IC14.1 | 38.88,72.88 36.38,72.88 35.5,73.75 IC13.19 | v32,20.88 37.75,20.88 37.81,20.81 | IC16.2 5.12,76.25 6.25,75.12 37.84,75.12 38.88,74.09 38.88,72.88
ID6  (via drill 0.2)
  Top 0.254: v32.62,97.62 32.62,92.62 32,92 32,77.88 | 32,77.88 32,74.75 32.88,73.88 IC13.20 33.76,72.95 33.76,56.45 IC9.20 | v31.98,77.88 32,77.88 | IC4.3 95.25,23.12 IC6.6 95.12,23.25 v95.12,26.75 | v41.5,54.75 41.5,36.88 39.75,35.12 v39.75,26.75 39.75,20.26 IC7.10
  Bottom 0.254: v32.62,97.62 33.25,97.62 34.12,98.5 47.5,98.5 49.12,100.12 IC17.37 | v31.98,77.88 9.12,77.88 7.62,76.38 IC16.3 | IC14.2 52.25,72.12 50.75,70.62 48.62,70.62 46.88,72.38 34.38,72.38 33,73.75 IC13.20 | v41.5,54.75 33.75,54.75 33,55.5 IC9.20 | v39.75,26.75 v95.12,26.75
ID7  (via drill 0.2)
  Top 0.254: v47.92,14.25 47.92,19.06 IC7.13 47,20 v47,21.38 | v55.75,82.72 55.75,73.12 54.88,72.25 IC14.3 | v29.5,77.12 29.5,74.75 30.38,73.88 IC13.21 30.39,65.96 31.22,65.13 31.22,57.47 30.39,56.64 IC9.21 30.39,52.66 31.23,51.81 31.23,41.3 32,40.53 32,38.8 30.88,37.67 v30.88,21.38 | IC6.11 95.21,30.2 96.89,28.52 96.89,18.32 97.79,17.42 IC4.2
  Bottom 0.254: v47.92,14.25 80.6,14.25 81.3,14.95 81.3,17.6 82.1,18.4 96.2,18.4 IC4.2 | v55.75,82.72 50.5,82.72 IC17.4 47.03,81.88 39.6,81.88 34.85,77.12 v29.5,77.12 10.88,77.12 10.12,76.38 IC16.4 | v30.88,21.38 v47,21.38
IEI  (via drill 0.2)
  Top 0.254: v95.67,27.55 95.67,26.2 96.38,25.5 96.38,6.24 97.34,5.27 99.25,5.27 X1.80 | v48.12,29.5 48.12,38.62 47.08,39.67 47.08,48.52 v46.7,48.9 | X9.1 39.7,77.74 v39.7,48.9
  Bottom 0.254: v95.67,27.55 50.83,27.55 48.88,29.5 v48.12,29.5 | IC10.1 49.24,48.9 v46.7,48.9 v39.7,48.9
IEO  (via drill 0.2)
  Top 0.254: v66.62,83.12 66.62,75 69.75,71.88 v69.75,49.38 | v67.62,49.25 67.62,18.73 67.27,18.38 67.05,18.38 66.38,17.7 v66.38,11.25
  Bottom 0.254: v66.62,83.12 64.88,84.88 57.62,84.88 56.88,84.12 IC17.7 | 67.62,49.38 59,49.38 58.25,50.12 IC10.4 | 67.62,49.38 v69.75,49.38 | v67.62,49.25 67.62,49.38 | v66.38,11.25 95.02,11.25 96.5,9.77 96.5,3.58 97.34,2.73 99.25,2.73 X1.79
IIEI  (via drill 0.2)
  Top 0.254: IC16.13 33,76.25 33.86,75.39 36.01,75.39 v36.25,75.62
  Bottom 0.254: v36.25,75.62 38.62,78 42.5,78 X9.2
IRDY
  Top 0.254: IC10.6 63.38,50.13 63.38,47.8 IC8.17
IRX
  Bottom 0.254: X10.2 95.43,86.57 97.75,86.57 98.96,85.37 98.96,62.2 97.81,61.05 JP102.1 JP103.1
ITX
  Bottom 0.254: JP103.3 JP102.3 96.19,60.91 98.58,63.3 98.58,72.37 97.68,73.26 97.17,73.26 94.5,75.94 X7.2
MA14  (via drill 0.2)
  Top 0.254: 14,74.62 10.88,74.62 10.12,73.88 IC13.29 | 14,74.62 14,56.38 13.87,56.24 13.87,54.88 14.62,54.12 v14.62,41.25 | v60.62,96.12 60.62,94.5 63.38,91.75 63.38,70.38 64.88,68.88 IC11.10 | v14,79.88 14,74.62 | v33.88,79.88 33.88,93.38 33.2,94.05 v33.2,96.12 33.2,98.9 RN1.6
  Bottom 0.254: v14.62,41.25 8.38,41.25 7.62,40.5 IC9.3 | v60.62,96.12 v33.2,96.12 | v33.88,79.88 v14,79.88
MA15  (via drill 0.2)
  Top 0.254: v69.25,53.62 69.25,67 67.5,68.75 IC11.9 | RN1.5 30,98.24 30,92.62 29.57,92.19 29.57,86.56 31.38,84.75 31.38,73.5 31.6,73.27 31.6,56.97 31.5,56.87 v31.5,53.62
  Bottom 0.254: IC9.31 7.5,58.12 IC13.3 7.6,58.22 8.43,59.05 25.66,59.05 26.75,57.96 26.75,55.52 28.65,53.62 v31.5,53.62 v69.25,53.62
MA16  (via drill 0.2)
  Top 0.254: RN1.4 27.12,97.91 27.12,92.25 27,92.12 27,77.12 26.65,76.77 26.65,75.74 27,75.38 v27,59.75 | IC9.2 4.14,41.23 4.14,57.38 IC13.2 | IC11.7 64.97,61.22 v64.97,63.75
  Bottom 0.254: v64.97,63.75 48.5,63.75 45.38,60.62 36.62,60.62 33.38,57.38 29.88,57.38 27.62,59.62 27,59.62 | 27,59.62 6.38,59.62 5,58.25 IC13.2 | v27,59.75 27,59.62
MA17  (via drill 0.2)
  Top 0.254: v62.38,53.12 62.38,61.12 IC11.6 | v7.88,98.62 7.88,92.75 8.43,92.19 8.43,74.68 IC13.30 6.7,72.95 6.7,56.45 IC9.30
  Bottom 0.254: v7.88,98.62 17.12,98.62 17.75,98 22.12,98 23.12,99 RN1.2 | IC9.30 7.62,55.62 8.96,56.95 25.17,56.95 26.25,55.88 26.25,55.46 28.59,53.12 v62.38,53.12
MA18  (via drill 0.2)
  Top 0.254: IC9.1 2.5,40.5 3.38,41.38 3.38,57 3.38,57.25 3.38,57.3 IC13.1 3.38,59.15 v3.38,78.38 | v65.25,93.12 65.25,80.12 65,79.88 IC14.10 | v39.75,100 v39.75,93.12 | RN1.3 23.88,97.19 v23.88,78.38
  Bottom 0.254: v39.75,93.12 v65.25,93.12 | v39.75,100 26.75,100 25.75,99 RN1.3 | v23.88,78.38 v3.38,78.38
MA19
  Top 0.254: IC10.12 70.88,58.25 70.25,58.88 70.25,77 67.5,79.75 IC14.9
MA20  (via drill 0.2)
  Top 0.254: v65.88,59.12 65.88,70.12 65,71 65,72.12 IC14.7
  Bottom 0.254: v65.88,59.12 67.38,59.12 68.25,58.25 IC10.13
N$1
  Top 0.254: Y2.1 73,31.5 73,30.12 IC5.3
N$2  (via drill 0.2)
  Top 0.254: IC16.11 28,76.36 v28,85.47
  Bottom 0.254: v28,85.47 52.9,85.47 54.25,84.12 IC17.6
N$3  (via drill 0.2)
  Top 0.254: v82.12,35.75 82.12,52.6 84.7,55.17 84.7,67.61 IC12.11
  Bottom 0.254: v82.12,35.75 79,35.75 X3.1
N$4
  Top 0.254: Y1.5 10,22.5 10,34.62 10.5,35.12 X4.1
N$5
  cutout Route2: 35.5,23.4 arc90 37,21.9 arc90 38.5,23.4 arc90 37,24.9 arc90
N$6
  Bottom 0.254: JP100.2 94.5,92.88 97.5,92.88 X14.3
N$7
  Bottom 0.254: R8.2 52.98,97.6 56.35,100.98 90.8,100.98 91.98,100.98 X14.2
N$8
  Bottom 0.254: R5.2 45.5,94.12 46.5,95.12 61,95.12 61.38,95.5 73.5,95.5 77.5,91.5 91,91.5 92.46,90.04 X10.1 97.16,90.04 X14.4
N$9
  cutout Route2: 47,23.4 arc90 48.5,21.9 arc90 50,23.4 arc90 48.5,24.9 arc90
N$10
  cutout Route2: 23.5,23.5 arc90 25,22 arc90 26.5,23.5 arc90 25,25 arc90
N$11  (via drill 0.2)
  Top 0.254: v68.4,82.1 v68.4,91.5 | X7.1 96.3,81.34 96.3,86.64 X14.5
  Bottom 0.254: X7.1 91.94,82.1 v68.4,82.1 | v68.4,91.5 68.36,91.46 46.28,91.46 R3.2
N$12
  Bottom 0.254: R1.2 45.5,87 46.62,85.88 56.12,85.88 56.62,85.38 77.12,85.38 79.38,83.12 95.38,83.12 97.5,85.25 X14.6
N$13
  cutout Route2: 74.6,19.8 arc90 76.1,18.3 arc90 77.6,19.8 arc90 76.1,21.3 arc90
N$14
  Bottom 0.254: JP101.2 94.5,71.88 97.5,71.88 X8.3
N$15  (via drill 0.2)
  Top 0.254: v84.15,96.55 91.95,88.75 94.58,88.75 95.44,87.89 95.44,83.78 93.56,81.9 93.56,78.75 94.01,78.3 94.53,78.3 96.06,76.77 96.06,75.9 X8.2
  Bottom 0.254: v84.15,96.55 81.49,96.55 80.44,97.6 R9.2
N$16
  cutout Route2: 79.5,19.9 arc90 81,18.4 arc90 82.5,19.9 arc90 81,21.4 arc90
N$17
  Top 0.254: X8.4 95.66,71.22 95.66,74.63 94.59,75.7 94.47,75.7 92.72,77.45 92.72,83.18 X10.3 85.36,94.1 R6.2
N$18
  Top 0.254: Y2.2 71.5,34.25 75.5,30.25 75.5,30.12 IC5.2
N$19
  Top 0.254: X8.5 94.5,69.84 X7.3 89.56,74.46 84.77,79.25 84.77,82.47 83.61,83.63 83.61,89.17 R4.2
N$20  (via drill 0.2)
  Top 0.254: v72.88,64.75 72.88,86.25 72.12,87 R2.2
  Bottom 0.254: v72.88,64.75 73.25,64.38 97.5,64.38 X8.6
N$21
  cutout Route2: 97.1,19.9 arc90 98.6,18.4 arc90 100.1,19.9 arc90 98.6,21.4 arc90
N$22
  cutout Route2: 6.5,50.5 arc90 8,49 arc90 9.5,50.5 arc90 8,52 arc90
N$23
  cutout Route2: 6.5,68.5 arc90 8,67 arc90 9.5,68.5 arc90 8,70 arc90
N$24
  cutout Route2: 10.9,86.6 arc90 12.4,85.1 arc90 13.9,86.6 arc90 12.4,88.1 arc90
N$25
  cutout Route2: 43.5,74.6 arc90 45,73.1 arc90 46.5,74.6 arc90 45,76.1 arc90
N$26
  cutout Route2: 43.5,68.1 arc90 45,66.6 arc90 46.5,68.1 arc90 45,69.6 arc90
N$27
  cutout Route2: 43.4,56.4 arc90 44.9,54.9 arc90 46.4,56.4 arc90 44.9,57.9 arc90
N$28
  cutout Route2: 43.5,49.9 arc90 45,48.4 arc90 46.5,49.9 arc90 45,51.4 arc90
N$29
  cutout Route2: 70.5,78.6 arc90 72,77.1 arc90 73.5,78.6 arc90 72,80.1 arc90
N$30
  cutout Route2: 70.5,67.6 arc90 72,66.1 arc90 73.5,67.6 arc90 72,69.1 arc90
N$31
  cutout Route2: 60.3,89.5 arc90 61.8,88 arc90 63.3,89.5 arc90 61.8,91 arc90
PG_RES
  Top 0.254: IC11.11 62.38,68.88 62,69.25 62,70.75 61.5,71.25 61.5,78.88 62.38,79.75 IC14.11
  Bottom 0.254: IC15.6 88.5,72.25 83.12,77.62 64.62,77.62 62.5,79.75 IC14.11
RTC_CE
  Bottom 0.254: IC5.5 72.75,24.75 83.5,24.75 85,23.25 IC6.2
RTC_CLK  (via drill 0.2)
  Top 0.254: v75.62,25.75 75.62,22.5 IC5.7
  Bottom 0.254: v75.62,25.75 95.25,25.75 97.75,23.25 IC6.7
RTC_IN
  Bottom 0.254: IC6.10 97.75,34.65 99.05,35.95 99.05,37.95 86.04,50.96 IC12.5
RTC_IO  (via drill 0.2)
  Top 0.254: v73.88,31.12 73.88,23.25 73.12,22.5 IC5.6 | v78,31.12 78,38.62 80,40.62 80,58.1 78.42,59.68 IC12.2
  Bottom 0.254: v78,31.12 v73.88,31.12 | IC12.6 88.5,61.25 87,62.75 80,62.75 78.5,61.25 IC12.2
RTC_WE  (via drill 0.2)
  Top 0.254: v98.05,36.92 94.25,33.12 94.25,24.75 92.75,23.25 IC6.5
  Bottom 0.254: v98.05,36.92 83.5,51.48 IC12.4
RX  (via drill 0.2)
  Route15 0.254: v97,56.9 91.44,51.34 91.44,5.08 X1.71
  Bottom 0.254: JP103.2 v97,56.9
RXDA  (via drill 0.2)
  Top 0.254: v69.5,93.75 69.5,84.12 IC17.12
  Bottom 0.254: v69.5,93.75 55.88,93.75 55.62,94 R5.1
RXDB
  Top 0.254: R6.1 69.51,96.61 IC17.29
TO0
  Top 0.254: X13.3 11.62,97.42 11.62,96.62 17.73,90.52 IC16.7
TO1
  Top 0.254: IC16.8 20.27,76.36 18.62,78 18.62,92.75 17.99,93.39 17.99,93.59 X13.5
TO2  (via drill 0.2)
  Top 0.254: v26,97.5 26,94.12 24.38,92.5 24.38,77.88 22.81,76.31 IC16.9
  Bottom 0.254: X13.7 v26,97.5
TRG0
  Top 0.254: X13.2 9,100 10.12,98.88 10.12,96.81 IC16.23
TRG1
  Top 0.254: X13.4 12.75,98.83 12.75,97.25 13.63,96.38 14.43,96.38 16,94.8 16,93.48 IC16.22
TRG2
  Top 0.254: X13.6 15.25,98.87 16.83,98.87 18.81,96.89 18.81,93.21 IC16.21
TRG3
  Top 0.254: X13.8 16.62,100 20.88,95.75 20.88,94.7 22.81,92.76 IC16.20
TX  (via drill 0.2)
  Route15 0.254: v97,58.5 91.06,52.56 91.06,8.77 88.9,6.61 88.9,5.08 X1.69
  Bottom 0.254: JP102.2 v97,58.5
TXDA  (via drill 0.2)
  Top 0.254: v77.12,89.62 77.12,84.12 IC17.15
  Bottom 0.254: v77.12,89.62 63,89.62 62.12,90.5 62.02,90.6 R3.1
TXDB
  Top 0.254: IC17.26 77.13,100.13 73.5,96.5 73.5,92.08 R4.1
VBAT  (via drill 0.2)
  Top 0.254: v80.5,22.5 81.12,23.12 81.12,33.38 91.5,43.75 U1.3
  Bottom 0.254: v80.5,22.5 78.12,22.5 IC5.8

## Text on the board
tNames: RCBus compatible / CPU, CTC. SIO2, RTC / Board with CLK
bNames: RCBus compatible / CPU, CTC. SIO2, RTC / Board with CLK